# EAGLE design Arduino_interface (EAGLE 9.3.0)
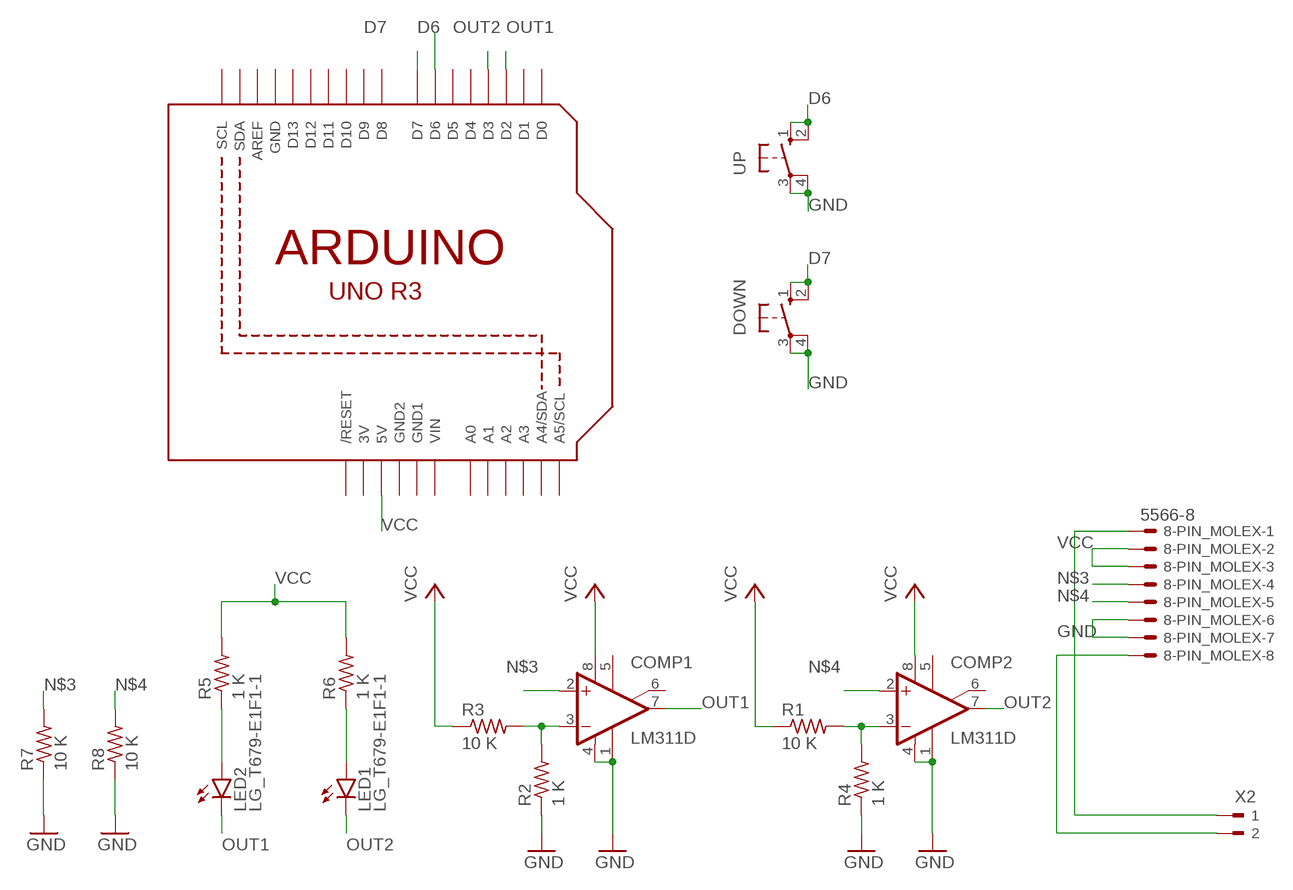
[diagram p0: schematic, sheet 1]

## Parts
8-PIN_MOLEX  5566-8  [5566-8]
COMP1  LM311D  [SO08]
COMP2  LM311D  [SO08]
DOWN  10-XX  [B3F-10XX]
LED1  LG_T679-E1F1-1  [PLCC2]
LED2  LG_T679-E1F1-1  [PLCC2]
Q1  ARDUINOR3-NOIOREF-NOTEXT  [ARDUINOR3-NOTEXT-NOIOREF]
R1  10 K  R-US_M1206  [M1206]
R2  1 K  R-US_M1206  [M1206]
R3  10 K  R-US_M1206  [M1206]
R4  1 K  R-US_M1206  [M1206]
R5  1 K  R-US_M1206  [M1206]
R6  1 K  R-US_M1206  [M1206]
R7  10 K  R-US_M0805  [M0805]
R8  10 K  R-US_M0805  [M0805]
UP  10-XX  [B3F-10XX]
X2  180-2  [180-2]

## Nets
D6: Q1.D6 UP.1(S) UP.2(S1)
D7: DOWN.1(S) DOWN.2(S1) Q1.D7
GND: 8-PIN_MOLEX.6 8-PIN_MOLEX.7 COMP1.1(GND) COMP1.4(V-) COMP2.1(GND) COMP2.4(V-) DOWN.3(P) DOWN.4(P1) R2.1 R4.1 R7.1 R8.1 UP.3(P) UP.4(P1)
N$1: COMP1.3(-IN) R2.2 R3.2
N$2: COMP2.3(-IN) R1.2 R4.2
N$3: 8-PIN_MOLEX.4 COMP1.2(+IN) R7.2
N$4: 8-PIN_MOLEX.5 COMP2.2(+IN) R8.2
N$5: 8-PIN_MOLEX.1 X2.1
N$6: 8-PIN_MOLEX.8 X2.2
N$7: LED2.A R5.1
N$8: LED1.A R6.1
OUT1: COMP1.7(OUT) LED2.C Q1.D2
OUT2: COMP2.7(OUT) LED1.C Q1.D3
VCC: 8-PIN_MOLEX.2 8-PIN_MOLEX.3 COMP1.8(V+) COMP2.8(V+) Q1.5V R1.1 R3.1 R5.2 R6.2
Unconnected: COMP1.5(ON) COMP1.6(ON/STR) COMP2.5(ON) COMP2.6(ON/STR) Q1.A0 Q1.A1 Q1.A2 Q1.A3 Q1.A4(A4/SDA) Q1.A5(A5/SCL) Q1.AREF Q1.D0 Q1.D1 Q1.D4 Q1.D5 Q1.D8 Q1.D9 Q1.D10 Q1.D11 Q1.D12 Q1.D13 Q1.RESET(/RESET) Q1.SCL Q1.SDA

## Power pins joined to a net without a drawn wire
3V: Q1.3V
GND: Q1.GND
GND1: Q1.GND1
GND2: Q1.GND2
VIN: Q1.VIN

## Library data of the parts
8-PIN_MOLEX = con-molex:5566-8: Mini FIT connector 8 pol Source: http://www.molex.com; OC_FARNELL: unknown; OC_NEWARK: unknown
COMP1 COMP2 = linear:LM311: COMPARATOR; MPN: LM311DT; OC_NEWARK: 08AC2764
DOWN = switch-omron:10-XX: OMRON SWITCH; MPN: B3F-1000; OC_FARNELL: 176432; OC_NEWARK: unknown; SPICEPREFIX: E
LED1 LED2 = led:*_T679-?-1: LC TOPLED® Low Current LED Source: http://catalog.osram-os.com .. LG_LS_LY_T679_OBS.pdf; COLOR: green; OC_NEWARK: unknown
Q1 = adafruit:ARDUINOR3-NOIOREF; OC_NEWARK: unknown; SPICEPREFIX: X
R1-R6 = rcl:R-US_: RESISTOR, American symbol; MPN: SFR16S0001003FR500; OC_NEWARK: 05R0211; SPICEPREFIX: R
R7 R8 = rcl:R-US_: RESISTOR, American symbol; SPICEPREFIX: R
UP = switch-omron:10-XX: OMRON SWITCH; MPN: B3F-1000; OC_FARNELL: 176432; OC_NEWARK: unknown
X2 = con-weidmueller-sl35:180-2: WEIDMUELLER CLAMP CONNECTOR; OC_FARNELL: unknown; OC_NEWARK: unknown

## Board
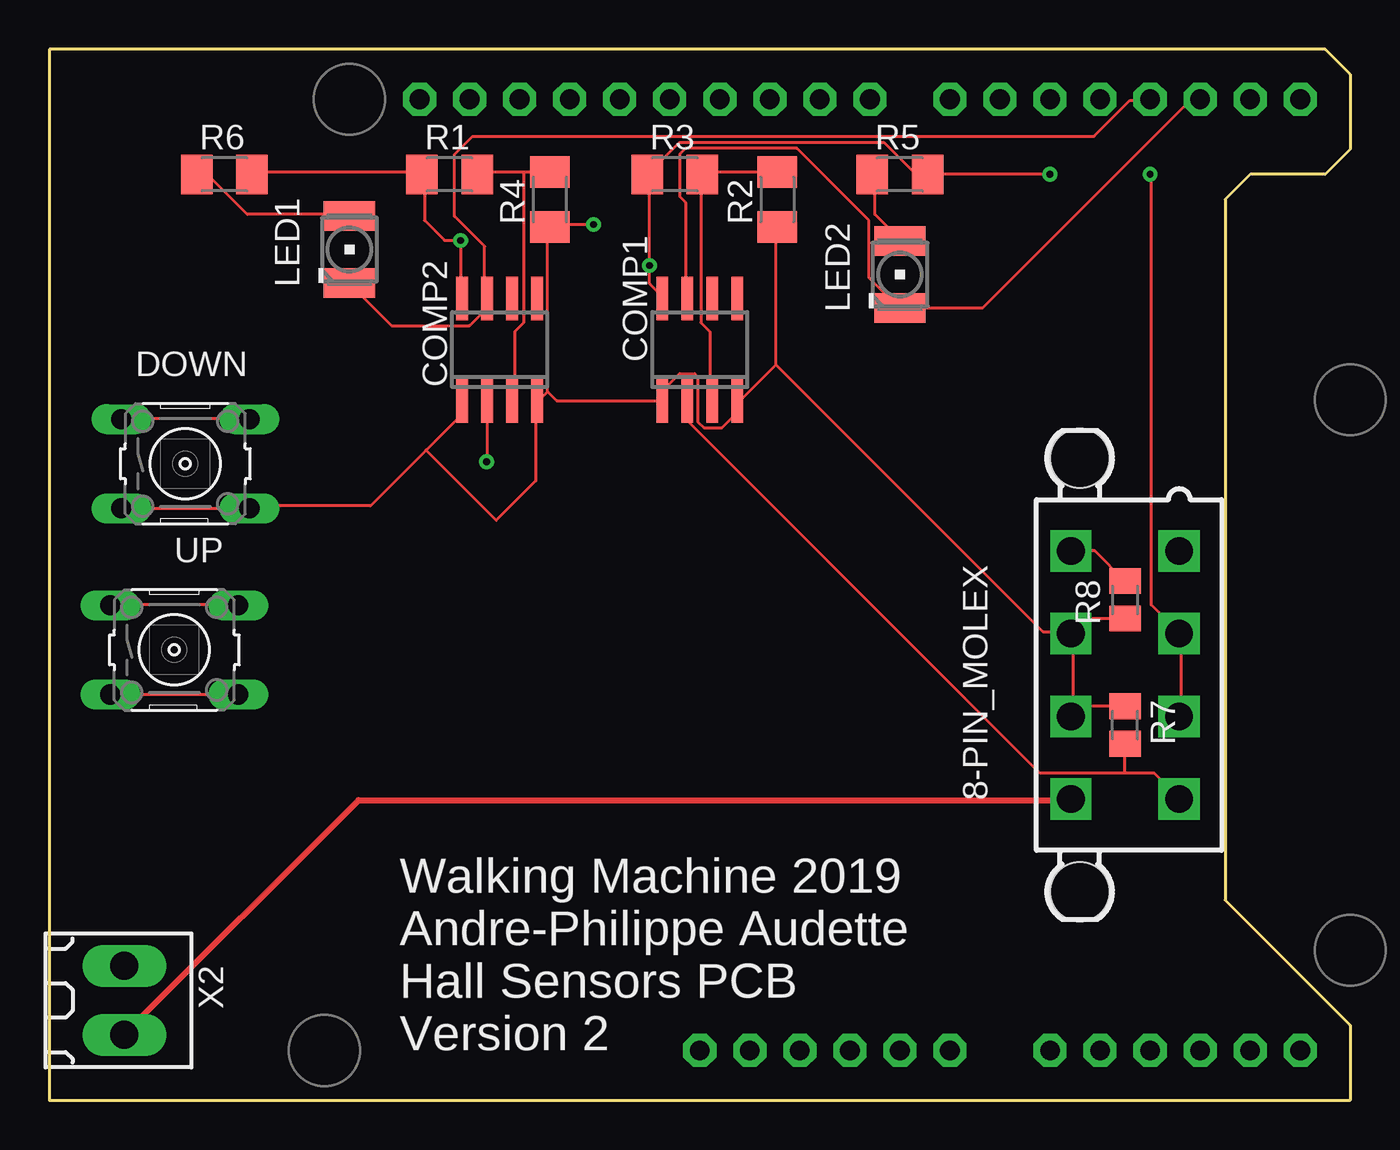
[diagram p1: board, top side]
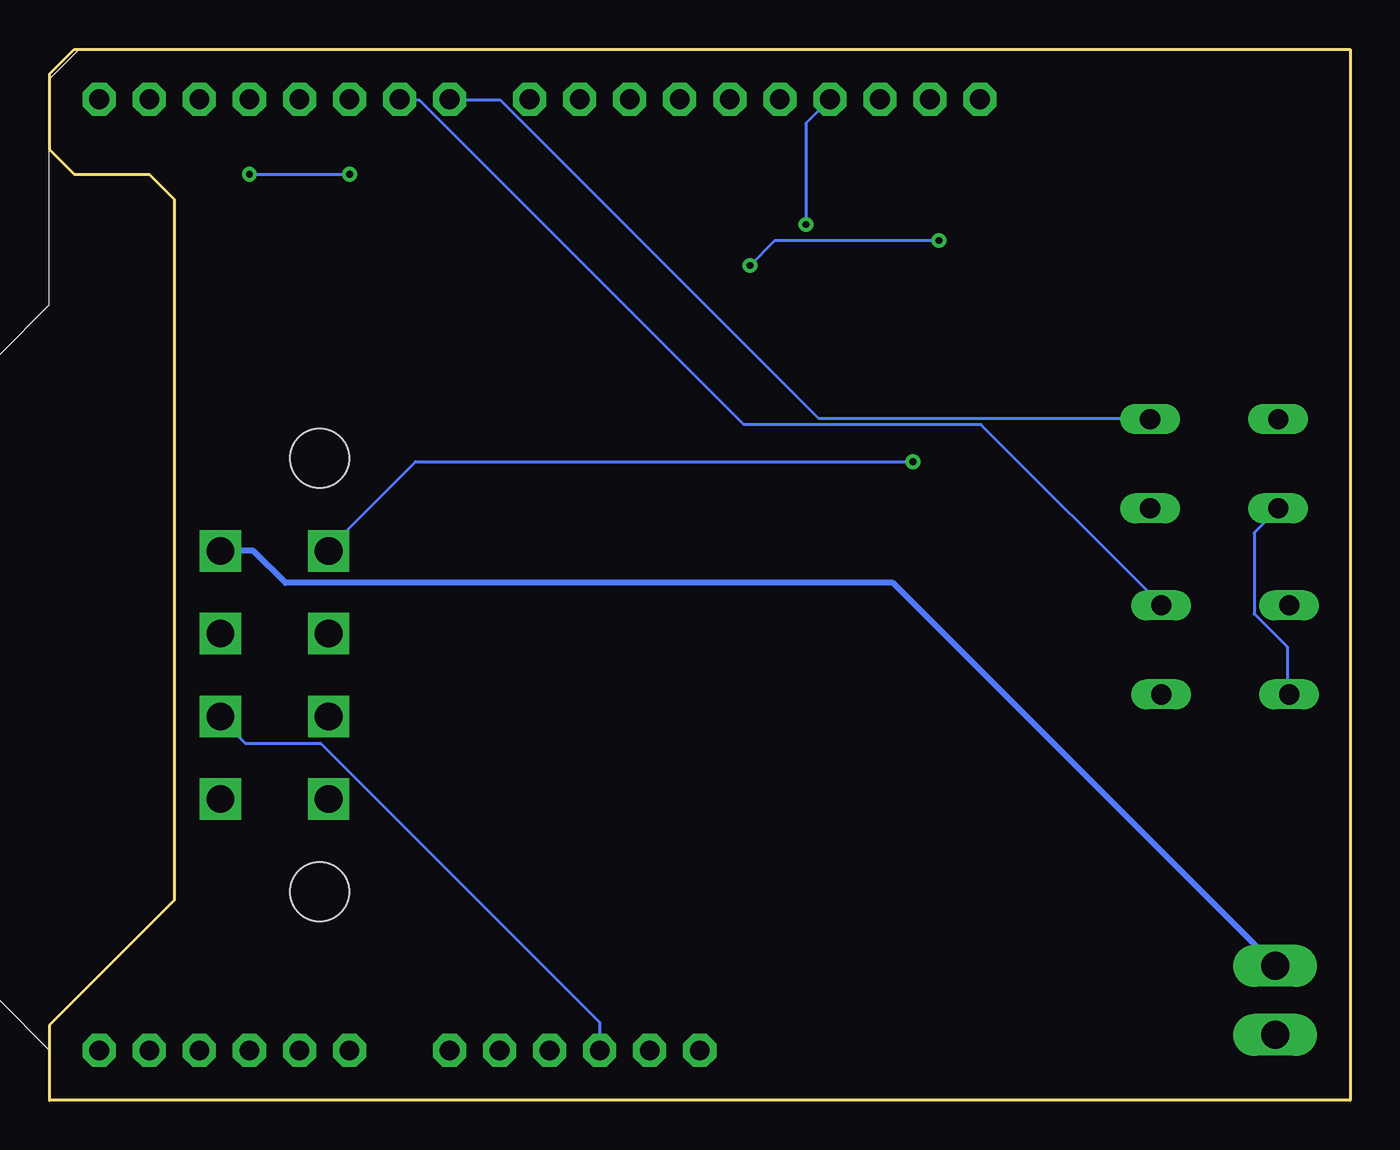
[diagram p2: board, bottom side, seen from below]

Size 66.04 x 53.34 mm. Coordinates in mm from the lower left corner, seen from the top.
Outline: 0,53.34 0,0 66.04,0 66.04,3.81 59.69,10.16 59.69,45.72 60.96,46.99 64.77,46.99 66.04,48.26 66.04,52.07 64.77,53.34 0,53.34
Copper layers (1*16): Top 0.035mm / dielectric 1.5mm / Bottom 0.035mm
Design rules "default": minimum track width 6mil, minimum drill 0.35mm, track to track 6mil, track to pad 6mil, pad to pad 6mil, via to via 6mil, smd to smd 6mil, copper to edge 40mil, drill to drill 6mil, minimum pad ring 10mil, minimum via ring 8mil, stop-mask expansion 4mil, vias tented up to drill 0mil, thermal gap 10mil

### Footprints (pad centres in the part's own frame; a part is rotated, then mirrored left to right if it is on the bottom)
5566-8 = drill 1.4 square: 1 6.3,-2.75; 2 2.1,-2.75; 3 -2.1,-2.75; 4 -6.3,-2.75; 5 6.3,2.75; 6 2.1,2.75; 7 -2.1,2.75; 8 -6.3,2.75 | hole 3: 11,2.29; -11,2.29
SO08 = smd 0.6 x 2.2: 1 -1.905,-2.6; 2 -0.635,-2.6; 3 0.635,-2.6; 4 1.905,-2.6; 5 1.905,2.6; 6 0.635,2.6; 7 -0.635,2.6; 8 -1.905,2.6
B3F-10XX = drill 1.016 long: 1 -3.251,2.261; 2 3.251,2.261; 3 -3.251,-2.261; 4 3.251,-2.261
PLCC2 = smd 2.6 x 1.5: A 0,1.7; C 0,-1.7
ARDUINOR3-NOTEXT-NOIOREF = drill 1 pad 1.676 octagon: 3V 35.56,2.54; 5V 38.1,2.54; A0 50.8,2.54; A1 53.34,2.54; A2 55.88,2.54; A3 58.42,2.54; A4 60.96,2.54; A5 63.5,2.54; AREF 23.876,50.8; D0 63.5,50.8; D1 60.96,50.8; D2 58.42,50.8; D3 55.88,50.8; D4 53.34,50.8; D5 50.8,50.8; D6 48.26,50.8; D7 45.72,50.8; D8 41.656,50.8; D9 39.116,50.8; D10 36.576,50.8; D11 34.036,50.8; D12 31.496,50.8; D13 28.956,50.8; GND 26.416,50.8; GND1 43.18,2.54; GND2 40.64,2.54; RESET 33.02,2.54; SCL 18.796,50.8; SDA 21.336,50.8; VIN 45.72,2.54
M1206 = smd 1.6 x 2: 1 -1.4,0; 2 1.4,0
M0805 = smd 1.3 x 1.6: 1 -0.95,0; 2 0.95,0
180-2 = drill 1.422 long: 1 -1.75,0; 2 1.75,0

### Placement (x,y rotation side)
8-PIN_MOLEX  54.61,21.59 90 top
COMP1  33.02,38.1 0 top
COMP2  22.86,38.1 0 top
DOWN  6.91,32.31 0 top
LED1  15.24,43.18 0 top
LED2  43.18,41.91 0 top
Q1  0,0 0 top
R1  20.32,46.99 0 top
R2  36.96,45.72 90 top
R3  31.75,46.99 0 top
R4  25.4,45.72 90 top
R5  43.18,46.99 0 top
R6  8.89,46.99 0 top
R7  54.61,19.05 270 top
R8  54.61,25.4 90 top
UP  6.35,22.86 0 top
X2  3.81,5.08 270 top

### Tracks (layer width: path | path; a pad name or v marks a point on that pad's centre or on a via)
D6
  Top 0.152: UP.1 3.2,25.15 9.6,25.15 UP.2
  Bottom 0.152: Q1.D6 48.16,50.75 47.24,50.75 30.79,34.29 18.75,34.29 9.6,25.15 UP.2
D7
  Top 0.152: DOWN.1 3.66,34.59 10.06,34.59 DOWN.2
  Bottom 0.152: Q1.D7 45.72,50.75 43.13,50.75 26.98,34.59 10.21,34.59 DOWN.2
GND  (via drill 0.35)
  Top 0.152: 51.97,19.51 51.97,23.62 8-PIN_MOLEX.6 | 51.97,19.51 8-PIN_MOLEX.7 | 36.88,37.34 36.88,44.2 R2.1 | 36.88,37.34 35.05,35.51 COMP1.4 34.9,35.36 34.9,34.9 34.14,34.14 33.22,34.14 32.92,34.44 32.92,36.73 32.77,36.88 32,36.88 31.24,36.12 31.24,35.51 COMP1.1 31.09,35.51 25.76,35.51 25.3,35.97 | 36.88,37.34 50.44,23.77 51.82,23.77 8-PIN_MOLEX.6 | UP.3 3.2,20.57 9.6,20.57 UP.4 | DOWN.3 3.66,30.02 10.06,30.02 DOWN.4 10.21,30.17 16.31,30.17 19.13,32.99 | 25.3,35.97 25.3,44.2 R4.1 25.45,44.35 25.55,44.45 v27.64,44.45 | 25.3,35.97 24.84,35.51 COMP2.4 24.69,35.36 24.69,31.45 22.68,29.44 19.13,32.99 | 21.03,34.9 21.03,35.36 COMP2.1 21.03,34.9 | 21.03,34.9 19.13,32.99 | R7.1 52.46,20 51.97,19.51 | R8.1 52.62,24.45 8-PIN_MOLEX.6
  Bottom 0.152: UP.3 3.2,20.73 3.2,23.01 4.88,24.69 4.88,28.8 3.66,30.02 DOWN.3 | Q1.GND 27.64,49.58 v27.64,44.45
N$1
  Top 0.152: R2.2 36.88,47.09 33.22,47.09 R3.2 33.07,46.94 33.07,39.47 33.53,39.01 33.53,35.51 COMP1.3
N$2
  Top 0.152: 24.08,47.09 25.3,47.09 R4.2 | 24.08,47.09 21.79,47.09 R1.2 | 24.08,47.09 24.08,39.47 23.62,39.01 23.62,35.51 COMP2.3
N$3
  Top 0.152: 54.61,16.61 56.08,16.61 57.3,15.39 8-PIN_MOLEX.4 | 54.61,16.61 50.29,16.61 32.46,34.44 32.46,35.36 COMP1.2 | 54.61,16.61 R7.2
N$4  (via drill 0.35)
  Top 0.152: v22.2,32.41 22.25,32.46 22.25,35.36 COMP2.2 | R8.2 53.07,27.89 8-PIN_MOLEX.5
  Bottom 0.152: v22.2,32.41 47.45,32.41 51.82,28.04 8-PIN_MOLEX.5
N$5
  Bottom 0.152: 57.3,27.89 8-PIN_MOLEX.1 | 3.81,6.86 X2.1
  Bottom 0.305: 57.3,27.89 55.68,27.89 54.05,26.26 23.22,26.26 3.81,6.86
N$6
  Top 0.152: 51.82,15.24 8-PIN_MOLEX.8 | 3.81,3.35 X2.2
  Top 0.305: 51.82,15.24 15.7,15.24 3.81,3.35
N$7
  Top 0.152: R5.1 41.91,46.94 41.91,44.96 43.13,43.74 LED2.A
N$8
  Top 0.152: R6.1 7.62,46.94 8.08,46.94 10.06,44.96 15.24,44.96 LED1.A
OUT1
  Top 0.152: COMP1.7 32.31,40.84 32.31,45.57 32,45.87 32,48.01 32.31,48.31 37.95,48.31 41.6,44.65 41.6,41.76 43.13,40.23 LED2.C 43.28,40.23 47.4,40.23 57.91,50.75 58.37,50.75 Q1.D2
OUT2
  Top 0.152: LED1.C 15.24,41.45 17.37,39.32 21.34,39.32 22.1,40.08 22.1,40.69 COMP2.7 22.1,40.84 22.1,43.33 20.57,44.86 20.57,48.01 21.49,48.92 53.03,48.92 54.86,50.75 55.78,50.75 Q1.D3
VCC  (via drill 0.35)
  Top 0.152: R6.2 10.36,47.09 18.9,47.09 R1.1 19.05,46.94 19.05,44.65 20.07,43.64 v20.88,43.64 20.88,40.84 COMP2.8 | COMP1.8 31.09,40.84 30.48,41.45 v30.48,42.37 30.48,46.94 R3.1 30.48,47.09 32,48.62 42.37,48.62 43.89,47.09 44.5,47.09 R5.2 | 8-PIN_MOLEX.3 57.45,19.51 57.45,23.62 8-PIN_MOLEX.2 57.3,23.77 55.93,25.15 55.93,46.94 v55.88,46.99 | 44.65,47.09 R5.2 | v50.8,46.99 R5.2
  Bottom 0.152: v30.48,42.37 29.21,43.64 v20.88,43.64 | Q1.5V 38.1,3.96 52.27,18.14 56.08,18.14 57.3,19.35 8-PIN_MOLEX.3 | v55.88,46.99 v50.8,46.99

### Text on the board
tNames: Walking Machine 2019 / Andre-Philippe Audette / Hall Sensors PCB / Version 2